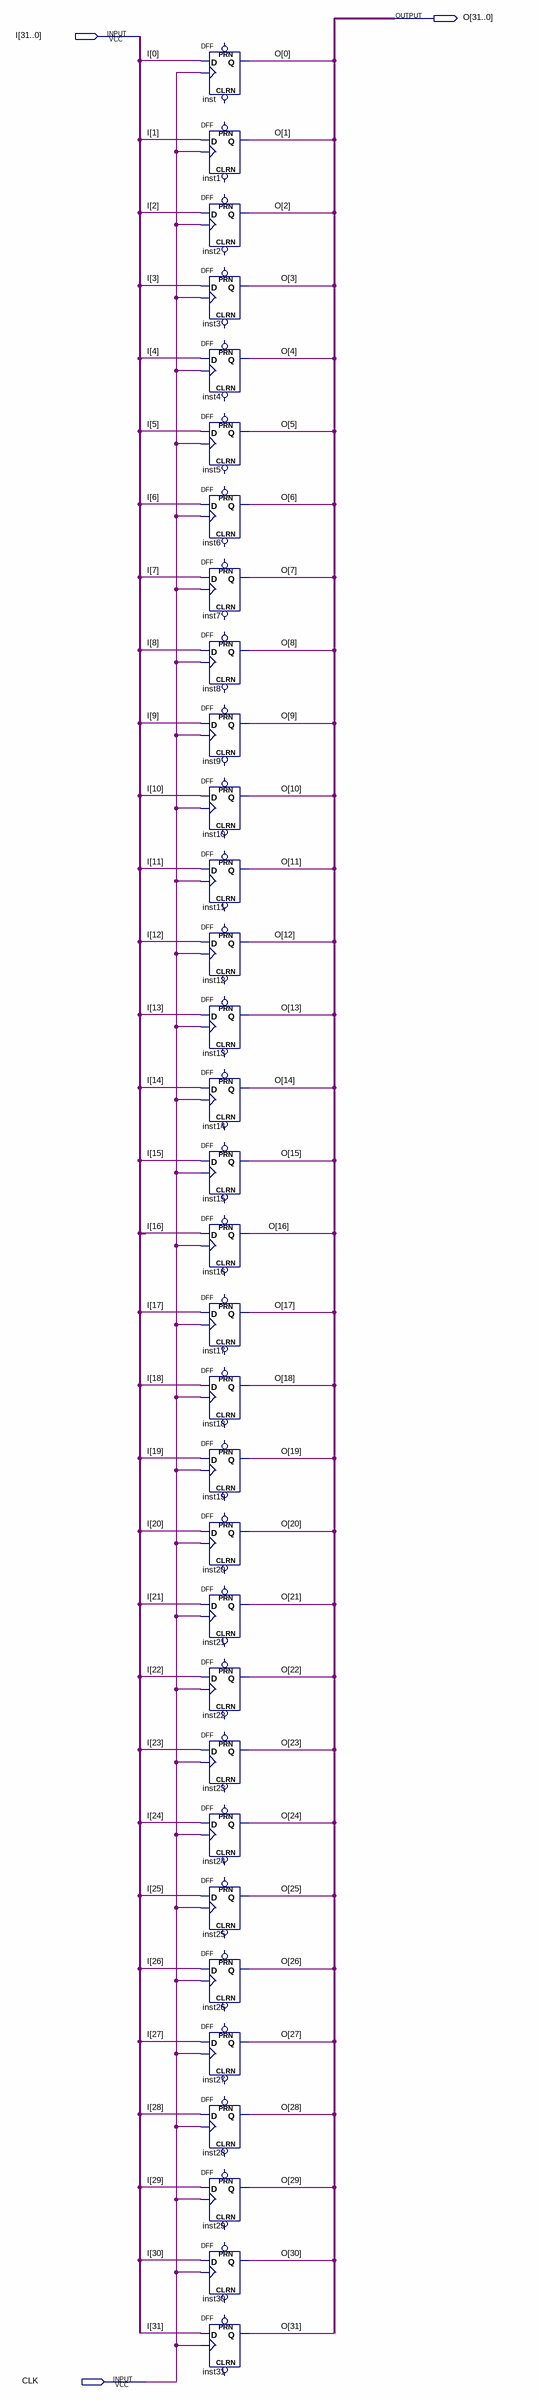
[diagram p0: schematic sheet]
// Quartus schematic Reg32.bdf as structural Verilog: 32 symbols, 3 pins
module Reg32 (
  input  [31:0] I,
  input  CLK,
  output [31:0] O
);

  DFF inst (.CLK(CLK), .D(I[0]), .Q(O[0]));  // open: CLRN, PRN
  DFF inst1 (.CLK(CLK), .D(I[1]), .Q(O[1]));  // open: CLRN, PRN
  DFF inst2 (.CLK(CLK), .D(I[2]), .Q(O[2]));  // open: CLRN, PRN
  DFF inst3 (.CLK(CLK), .D(I[3]), .Q(O[3]));  // open: CLRN, PRN
  DFF inst4 (.CLK(CLK), .D(I[4]), .Q(O[4]));  // open: CLRN, PRN
  DFF inst5 (.CLK(CLK), .D(I[5]), .Q(O[5]));  // open: CLRN, PRN
  DFF inst6 (.CLK(CLK), .D(I[6]), .Q(O[6]));  // open: CLRN, PRN
  DFF inst7 (.CLK(CLK), .D(I[7]), .Q(O[7]));  // open: CLRN, PRN
  DFF inst8 (.CLK(CLK), .D(I[8]), .Q(O[8]));  // open: CLRN, PRN
  DFF inst9 (.CLK(CLK), .D(I[9]), .Q(O[9]));  // open: CLRN, PRN
  DFF inst10 (.CLK(CLK), .D(I[10]), .Q(O[10]));  // open: CLRN, PRN
  DFF inst11 (.CLK(CLK), .D(I[11]), .Q(O[11]));  // open: CLRN, PRN
  DFF inst12 (.CLK(CLK), .D(I[12]), .Q(O[12]));  // open: CLRN, PRN
  DFF inst13 (.CLK(CLK), .D(I[13]), .Q(O[13]));  // open: CLRN, PRN
  DFF inst14 (.CLK(CLK), .D(I[14]), .Q(O[14]));  // open: CLRN, PRN
  DFF inst15 (.CLK(CLK), .D(I[15]), .Q(O[15]));  // open: CLRN, PRN
  DFF inst16 (.CLK(CLK), .D(I[16]), .Q(O[16]));  // open: CLRN, PRN
  DFF inst17 (.CLK(CLK), .D(I[17]), .Q(O[17]));  // open: CLRN, PRN
  DFF inst18 (.CLK(CLK), .D(I[18]), .Q(O[18]));  // open: CLRN, PRN
  DFF inst19 (.CLK(CLK), .D(I[19]), .Q(O[19]));  // open: CLRN, PRN
  DFF inst20 (.CLK(CLK), .D(I[20]), .Q(O[20]));  // open: CLRN, PRN
  DFF inst21 (.CLK(CLK), .D(I[21]), .Q(O[21]));  // open: CLRN, PRN
  DFF inst22 (.CLK(CLK), .D(I[22]), .Q(O[22]));  // open: CLRN, PRN
  DFF inst23 (.CLK(CLK), .D(I[23]), .Q(O[23]));  // open: CLRN, PRN
  DFF inst24 (.CLK(CLK), .D(I[24]), .Q(O[24]));  // open: CLRN, PRN
  DFF inst25 (.CLK(CLK), .D(I[25]), .Q(O[25]));  // open: CLRN, PRN
  DFF inst26 (.CLK(CLK), .D(I[26]), .Q(O[26]));  // open: CLRN, PRN
  DFF inst27 (.CLK(CLK), .D(I[27]), .Q(O[27]));  // open: CLRN, PRN
  DFF inst28 (.CLK(CLK), .D(I[28]), .Q(O[28]));  // open: CLRN, PRN
  DFF inst29 (.CLK(CLK), .D(I[29]), .Q(O[29]));  // open: CLRN, PRN
  DFF inst30 (.CLK(CLK), .D(I[30]), .Q(O[30]));  // open: CLRN, PRN
  DFF inst31 (.CLK(CLK), .D(I[31]), .Q(O[31]));  // open: CLRN, PRN
endmodule
